# EAGLE design Motherboard (EAGLE 7.5.0)
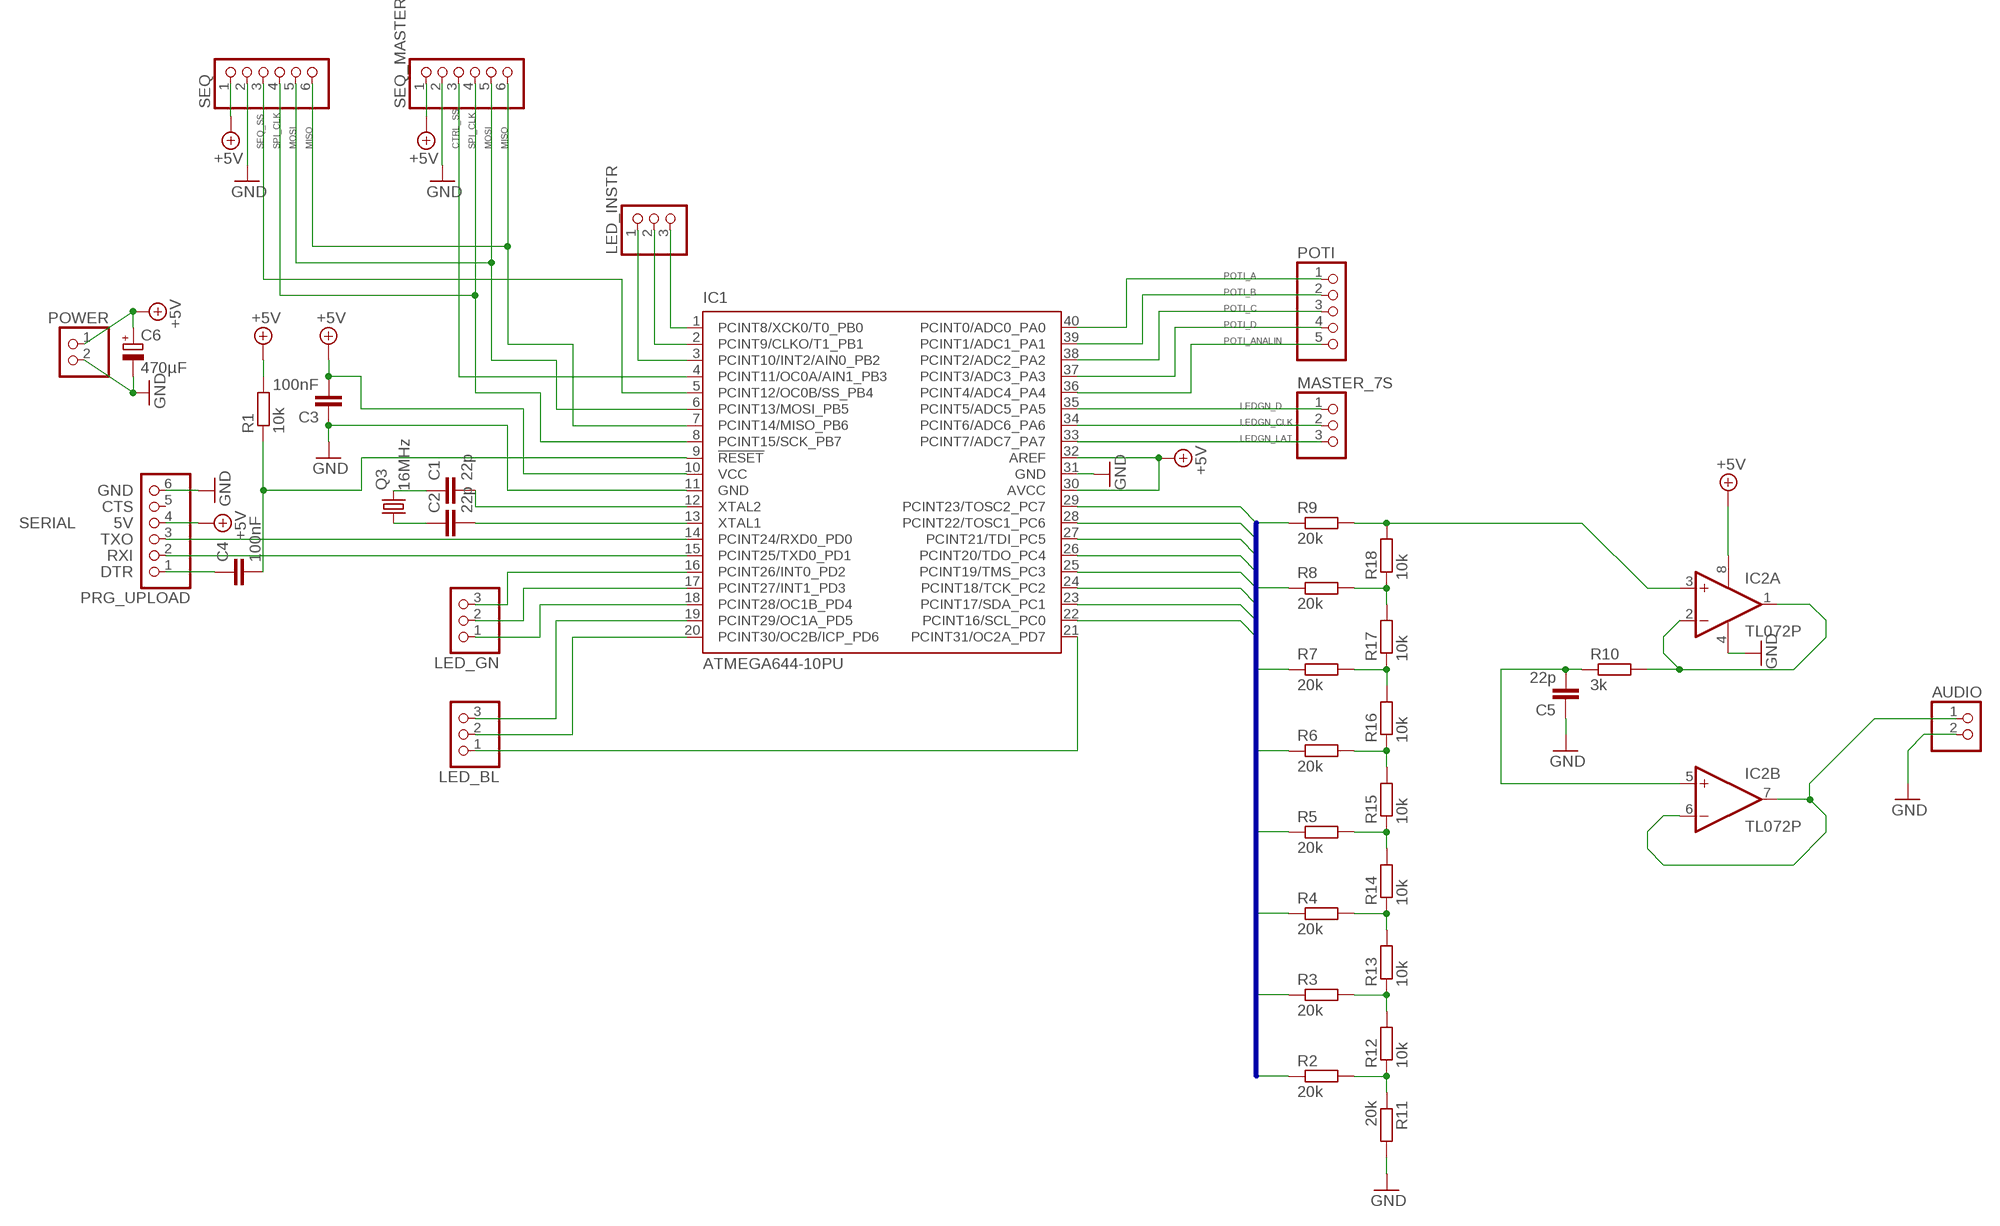
[diagram p0: schematic, sheet 1]

## Parts
AUDIO  PINHD-1X2  [1X02]
C1  22p  C-EU025-060X050  [C025-060X050]
C2  22p  C-EU025-060X050  [C025-060X050]
C3  100nF  C-EU025-060X050  [C025-060X050]
C4  100nF  C-EU025-060X050  [C025-060X050]
C5  22p  C-EU025-060X050  [C025-060X050]
C6  470µF  CPOL-EUE3.5-10  [E3,5-10]
IC1  ATMEGA644-10PU  [DIL40]
IC2  TL072P  [DIL08]
LED_BL  PINHD-1X3  [1X03]
LED_GN  PINHD-1X3  [1X03]
LED_INSTR  PINHD-1X3  [1X03]
MASTER_7S  PINHD-1X3  [1X03]
POTI  PINHD-1X5  [1X05]
POWER  PINHD-1X2  [1X02]
PRG_UPLOAD  PINHD-1X6  [1X06]
Q3  16MHz  CRYSTALHC18U-V  [HC18U-V]
R1  10k  R-EU_0204/7  [0204/7]
R2  20k  R-EU_0204/7  [0204/7]
R3  20k  R-EU_0204/7  [0204/7]
R4  20k  R-EU_0204/7  [0204/7]
R5  20k  R-EU_0204/7  [0204/7]
R6  20k  R-EU_0204/7  [0204/7]
R7  20k  R-EU_0204/7  [0204/7]
R8  20k  R-EU_0204/7  [0204/7]
R9  20k  R-EU_0204/7  [0204/7]
R10  3k  R-EU_0204/7  [0204/7]
R11  20k  R-EU_0204/7  [0204/7]
R12  10k  R-EU_0204/7  [0204/7]
R13  10k  R-EU_0204/7  [0204/7]
R14  10k  R-EU_0204/7  [0204/7]
R15  10k  R-EU_0204/7  [0204/7]
R16  10k  R-EU_0204/7  [0204/7]
R17  10k  R-EU_0204/7  [0204/7]
R18  10k  R-EU_0204/7  [0204/7]
SEQ  PINHD-1X6  [1X06]
SEQ_MASTER  PINHD-1X6  [1X06]

## Nets
+5V: C3.2 C6.+ IC1.10(VCC) IC1.30(AVCC) IC1.32(AREF) IC2.8(P:V+) POWER.1 PRG_UPLOAD.4 R1.2 SEQ.1 SEQ_MASTER.1
CTRL_SS: IC1.4(PCINT11/OC0A/AIN1_PB3) SEQ_MASTER.3
DA0: IC1.22(PCINT16/SCL_PC0) R2.1
DA1: IC1.23(PCINT17/SDA_PC1) R3.1
DA2: IC1.24(PCINT18/TCK_PC2) R4.1
DA3: IC1.25(PCINT19/TMS_PC3) R5.1
DA4: IC1.26(PCINT20/TDO_PC4) R6.1
DA5: IC1.27(PCINT21/TDI_PC5) R7.1
DA6: IC1.28(PCINT22/TOSC1_PC6) R8.1
DA7: IC1.29(PCINT23/TOSC2_PC7) R9.1
GND: AUDIO.2 C3.1 C5.1 C6.- IC1.11(GND) IC1.31(GND) IC2.4(P:V-) POWER.2 PRG_UPLOAD.6 R11.2 SEQ.2 SEQ_MASTER.2
LEDGN_CLK: IC1.34(PCINT6/ADC6_PA6) MASTER_7S.2
LEDGN_D: IC1.35(PCINT5/ADC5_PA5) MASTER_7S.1
LEDGN_LAT: IC1.33(PCINT7/ADC7_PA7) MASTER_7S.3
MISO: IC1.7(PCINT14/MISO_PB6) SEQ.6 SEQ_MASTER.6
MOSI: IC1.6(PCINT13/MOSI_PB5) SEQ.5 SEQ_MASTER.5
N$1: C1.1 Q3.2
N$2: C2.1 Q3.1
N$3: C2.2 IC1.13(XTAL1)
N$4: C1.2 IC1.12(XTAL2)
N$5: R3.2 R12.2 R13.1
N$6: R4.2 R13.2 R14.1
N$7: R5.2 R14.2 R15.1
N$8: R6.2 R15.2 R16.1
N$9: IC1.1(PCINT8/XCK0/T0_PB0) LED_INSTR.3
N$10: IC1.2(PCINT9/CLKO/T1_PB1) LED_INSTR.2
N$11: IC1.3(PCINT10/INT2/AIN0_PB2) LED_INSTR.1
N$12: R7.2 R16.2 R17.1
N$13: R8.2 R17.2 R18.1
N$14: R2.2 R11.1 R12.1
N$15: IC2.3(A:+IN) R9.2 R18.2
N$16: IC2.1(A:OUT) IC2.2(A:-IN) R10.2
N$17: IC1.16(PCINT26/INT0_PD2) LED_GN.3
N$18: IC1.17(PCINT27/INT1_PD3) LED_GN.2
N$19: IC1.18(PCINT28/OC1B_PD4) LED_GN.1
N$20: IC1.19(PCINT29/OC1A_PD5) LED_BL.3
N$21: IC1.20(PCINT30/OC2B/ICP_PD6) LED_BL.2
N$22: IC1.21(PCINT31/OC2A_PD7) LED_BL.1
N$23: C5.2 IC2.5(B:+IN) R10.1
N$24: AUDIO.1 IC2.6(B:-IN) IC2.7(B:OUT)
POTI_A: IC1.40(PCINT0/ADC0_PA0) POTI.1
POTI_ANALIN: IC1.36(PCINT4/ADC4_PA4) POTI.5
POTI_B: IC1.39(PCINT1/ADC1_PA1) POTI.2
POTI_C: IC1.38(PCINT2/ADC2_PA2) POTI.3
POTI_D: IC1.37(PCINT3/ADC3_PA3) POTI.4
RESET: C4.2 IC1.9(!RESET) R1.1
SEQ_SS: IC1.5(PCINT12/OC0B/SS_PB4) SEQ.3
SPI_CLK: IC1.8(PCINT15/SCK_PB7) SEQ.4 SEQ_MASTER.4
UPLOAD_DTR: C4.1 PRG_UPLOAD.1
UPLOAD_RXI: IC1.15(PCINT25/TXD0_PD1) PRG_UPLOAD.2
UPLOAD_TXO: IC1.14(PCINT24/RXD0_PD0) PRG_UPLOAD.3
Unconnected: PRG_UPLOAD.5

## Buses
DA[0..7]

## Notes on the sheet
- GND
- CTS
- SERIAL | 5V
- TXO
- RXI
- DTR

## Library data of the parts
AUDIO POWER = pinhead:PINHD-1X2: PIN HEADER
C1-C5 = resistor:C-EU: CAPACITOR, European symbol
C6 = resistor:CPOL-EU: POLARIZED CAPACITOR, European symbol
IC1 = atmel:ATMEGA644-*PU: 8-bit Microcontroller with 64K Bytes In-System Programmable Flash Auto generated by make-symbol-device-package-bsdl.ulp Rev. 34 Source: http://www.atmel.com/dyn/resources/prod_documents/doc2593.pdf; MPN: ATMEGA644V-10PU; OC_FARNELL: 1288342; OC_NEWARK: 23M5062
IC2 = linear:TL072: OP AMP
LED_BL LED_GN LED_INSTR MASTER_7S = pinhead:PINHD-1X3: PIN HEADER
POTI = pinhead:PINHD-1X5: PIN HEADER
PRG_UPLOAD SEQ SEQ_MASTER = pinhead:PINHD-1X6: PIN HEADER
Q3 = crystal:CRYSTAL: CRYSTAL; OC_FARNELL: unknown; OC_NEWARK: unknown
R1-R18 = resistor:R-EU_: RESISTOR, European symbol

## Board
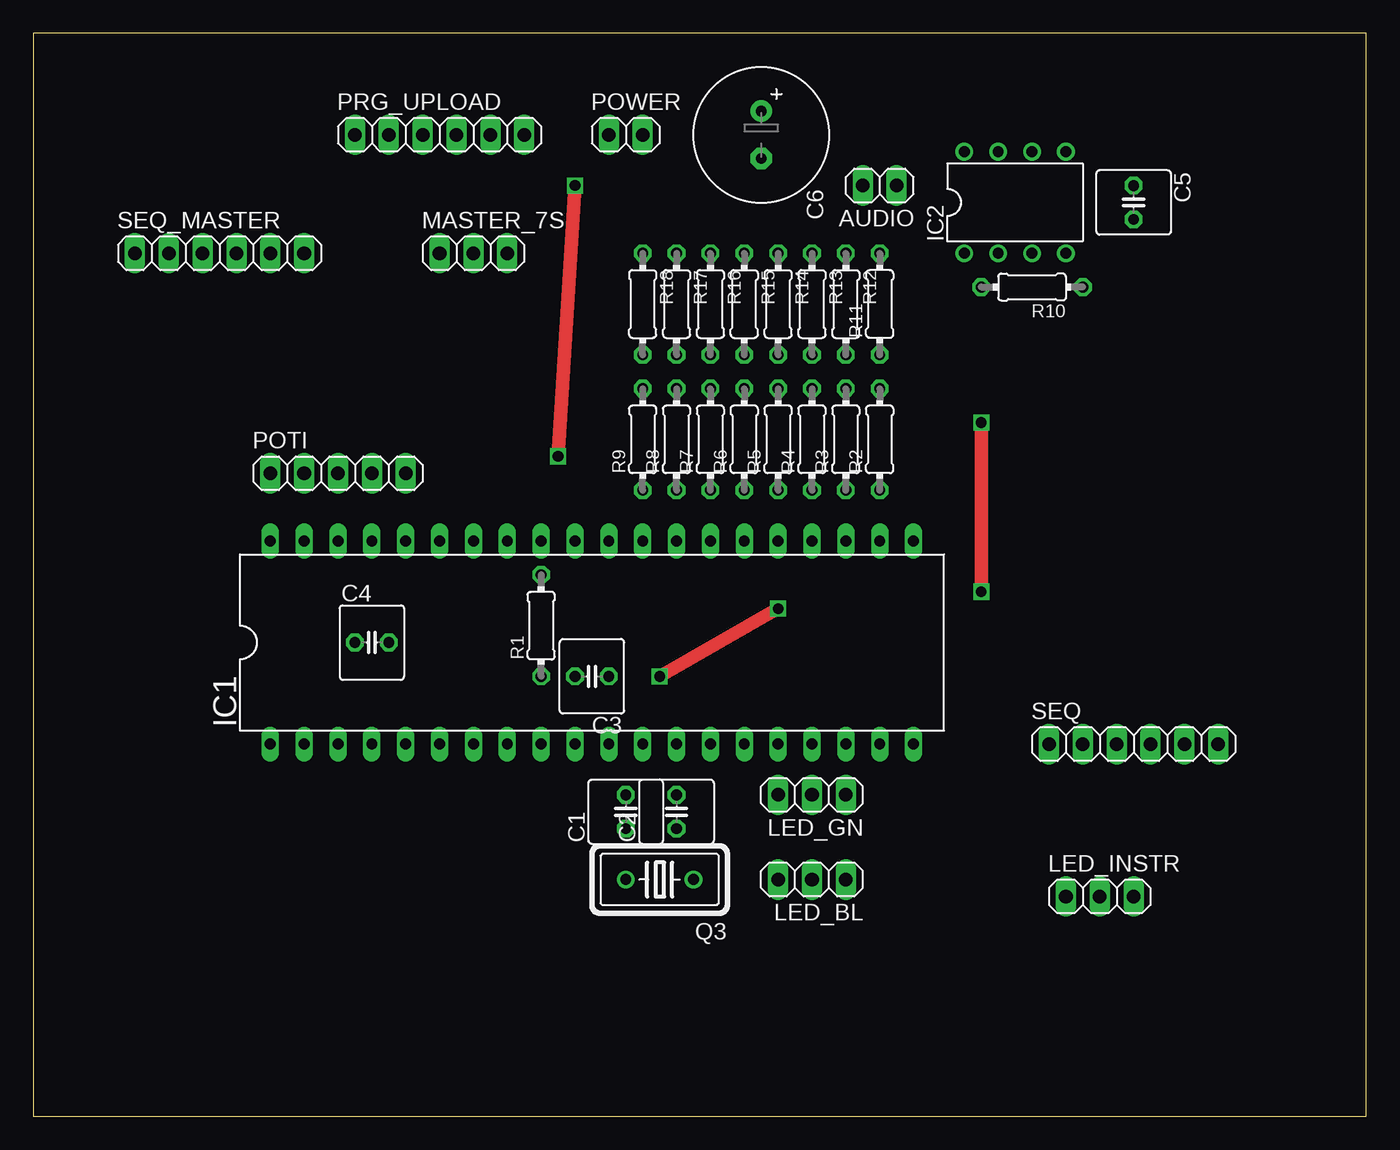
[diagram p1: board, top side]
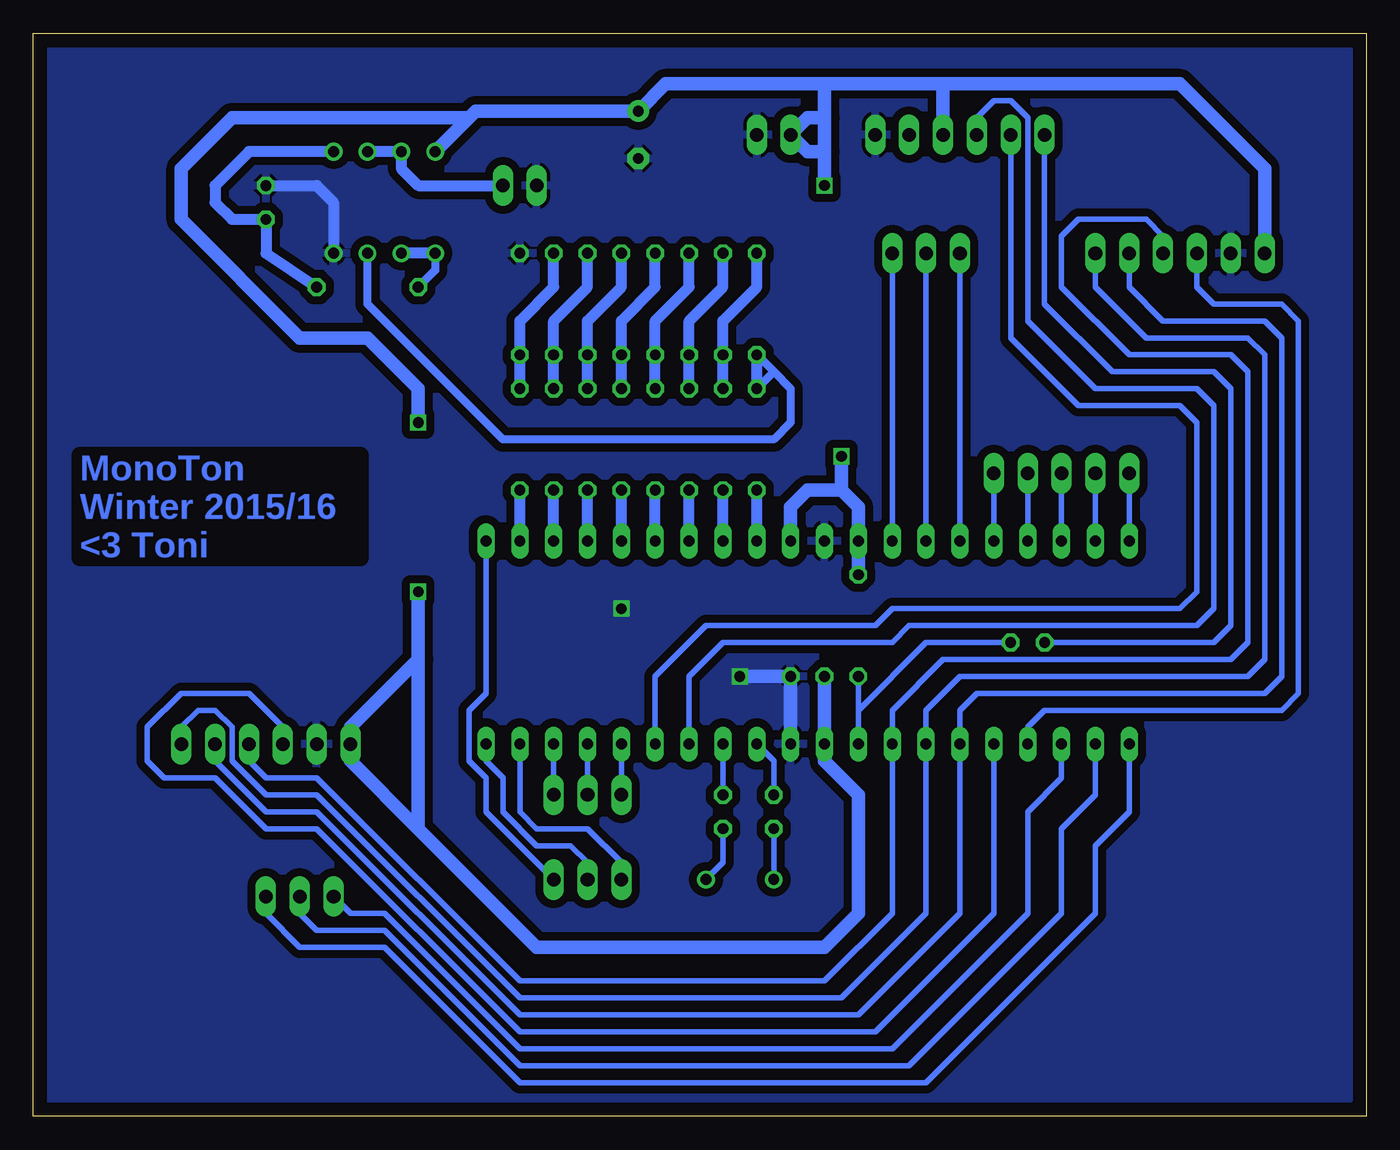
[diagram p2: board, bottom side, seen from below]

Size 100 x 81.27 mm. Coordinates in mm from the lower left corner, seen from the top.
Outline: 0,0 100,0 100,81.27 0,81.27 0,0
Copper layers (1*16): Top 0.035mm / dielectric 1.5mm / Bottom 0.035mm
Design rules "default": minimum track width 10mil, minimum drill 24mil, track to track 8mil, track to pad 8mil, pad to pad 8mil, via to via 8mil, smd to smd 8mil, copper to edge 40mil, drill to drill 8mil, minimum pad ring 10mil, minimum via ring 8mil, stop-mask expansion 4mil, vias tented up to drill 0mil, thermal gap 10mil

### Footprints (pad centres in the part's own frame; a part is rotated, then mirrored left to right if it is on the bottom)
1X02 = drill 1.016 long: 1 -1.27,0; 2 1.27,0
C025-060X050 = drill 0.813 octagon: 1 -1.27,0; 2 1.27,0
E3,5-10 = drill 0.813 pad 1.6: + -1.778,0 | drill 0.813 pad 1.6 octagon: - 1.778,0
DIL40 = drill 0.813 long: 1 -24.13,-7.62; 2 -21.59,-7.62; 3 -19.05,-7.62; 4 -16.51,-7.62; 5 -13.97,-7.62; 6 -11.43,-7.62; 7 -8.89,-7.62; 8 -6.35,-7.62; 9 -3.81,-7.62; 10 -1.27,-7.62; 11 1.27,-7.62; 12 3.81,-7.62; 13 6.35,-7.62; 14 8.89,-7.62; 15 11.43,-7.62; 16 13.97,-7.62; 17 16.51,-7.62; 18 19.05,-7.62; 19 21.59,-7.62; 20 24.13,-7.62; 21 24.13,7.62; 22 21.59,7.62; 23 19.05,7.62; 24 16.51,7.62; 25 13.97,7.62; 26 11.43,7.62; 27 8.89,7.62; 28 6.35,7.62; 29 3.81,7.62; 30 1.27,7.62; 31 -1.27,7.62; 32 -3.81,7.62; 33 -6.35,7.62; 34 -8.89,7.62; 35 -11.43,7.62; 36 -13.97,7.62; 37 -16.51,7.62; 38 -19.05,7.62; 39 -21.59,7.62; 40 -24.13,7.62
DIL08 = drill 0.813 pad 1.27: 1 -3.81,-3.81; 2 -1.27,-3.81; 3 1.27,-3.81; 4 3.81,-3.81; 5 3.81,3.81; 6 1.27,3.81; 7 -1.27,3.81; 8 -3.81,3.81
1X03 = drill 1.016 long: 1 -2.54,0; 2 0,0; 3 2.54,0
1X05 = drill 1.016 long: 1 -5.08,0; 2 -2.54,0; 3 0,0; 4 2.54,0; 5 5.08,0
1X06 = drill 1.016 long: 1 -6.35,0; 2 -3.81,0; 3 -1.27,0; 4 1.27,0; 5 3.81,0; 6 6.35,0
HC18U-V = drill 0.813: 1 -2.54,0; 2 2.54,0
0204/7 = drill 0.813 octagon: 1 -3.81,0; 2 3.81,0

### Placement (x,y rotation side)
AUDIO  63.5,69.85 180 top
C1  44.45,22.86 90 top
C2  48.26,22.86 90 top
C3  41.91,33.02 180 top
C4  25.4,35.56 0 top
C5  82.55,68.58 270 top
C6  54.61,73.66 270 top
IC1  41.91,35.56 0 top
IC2  73.66,68.58 0 top
LED_BL  58.42,17.78 180 top
LED_GN  58.42,24.13 180 top
LED_INSTR  80.01,16.51 0 top
MASTER_7S  33.02,64.77 0 top
POTI  22.86,48.26 0 top
POWER  44.45,73.66 0 top
PRG_UPLOAD  30.48,73.66 0 top
Q3  46.99,17.78 180 top
R1  38.1,36.83 90 top
R2  63.5,50.8 90 top
R3  60.96,50.8 90 top
R4  58.42,50.8 90 top
R5  55.88,50.8 90 top
R6  53.34,50.8 90 top
R7  50.8,50.8 90 top
R8  48.26,50.8 90 top
R9  45.72,50.8 90 top
R10  74.93,62.23 180 top
R11  63.5,60.96 90 top
R12  60.96,60.96 270 top
R13  58.42,60.96 270 top
R14  55.88,60.96 270 top
R15  53.34,60.96 270 top
R16  50.8,60.96 270 top
R17  48.26,60.96 270 top
R18  45.72,60.96 270 top
SEQ  82.55,27.94 0 top
SEQ_MASTER  13.97,64.77 0 top

### Tracks (layer width: path | path; a pad name or v marks a point on that pad's centre or on a via)
+5V  (via drill 0.8)
  Top 1.016: v39.37,49.53 v40.64,69.85 | v71.12,39.37 v71.12,52.07
  Bottom 1.016: 39.37,46.99 38.1,45.72 IC1.32 R1.2 | IC1.30 43.18,45.72 41.91,46.99 39.37,46.99 | SEQ_MASTER.1 7.62,71.12 13.97,77.47 31.75,77.47 | 31.75,77.47 40.64,77.47 | 40.64,77.47 52.58,77.47 C6.+ 66.8,75.44 67.31,74.93 | PRG_UPLOAD.4 31.75,77.47 | 39.37,46.99 v39.37,49.53 | C3.2 IC1.10 40.64,26.67 38.1,24.13 38.1,15.24 40.64,12.7 62.23,12.7 71.12,21.59 | 71.12,21.59 76.2,26.67 SEQ.1 76.2,29.21 71.12,34.29 | v71.12,52.07 71.12,54.61 74.93,58.42 80.01,58.42 88.9,67.31 88.9,71.12 85.09,74.93 67.31,74.93 | 67.31,74.93 IC2.8 | 71.12,21.59 71.12,34.29 | 71.12,34.29 v71.12,39.37 | 40.64,74.93 40.64,77.47 | v40.64,69.85 40.64,72.39 | 40.64,72.39 40.64,74.93 | 40.64,74.93 41.91,74.93 POWER.1 41.91,72.39 40.64,72.39
CTRL_SS
  Bottom 0.406: IC1.4 25.4,29.21 24.13,30.48 6.35,30.48 5.08,31.75 5.08,59.69 6.35,60.96 11.43,60.96 12.7,62.23 SEQ_MASTER.3
DA0
  Bottom 0.813: IC1.22 R2.1
DA1
  Bottom 0.813: IC1.23 R3.1
DA2
  Bottom 0.813: IC1.24 R4.1
DA3
  Bottom 0.813: IC1.25 R5.1
DA4
  Bottom 0.813: IC1.26 R6.1
DA5
  Bottom 0.813: IC1.27 R7.1
DA6
  Bottom 0.813: IC1.28 R8.1
DA7
  Bottom 0.813: IC1.29 R9.1
GND  (via drill 0.8)
  Top 1.016: v46.99,33.02 v55.88,38.1
  Bottom 0.813: C5.1 78.74,69.85 77.47,68.58 IC2.4
  Bottom 1.016: IC1.11 C3.1 v46.99,33.02
  pour Bottom (isolate 0.61): 1.27,80.01 1.27,1.27 99.06,1.27 99.06,80.01
LEDGN_CLK
  Bottom 0.406: MASTER_7S.2 IC1.34
LEDGN_D
  Bottom 0.406: IC1.35 MASTER_7S.1
LEDGN_LAT
  Bottom 0.406: MASTER_7S.3 IC1.33
MISO
  Bottom 0.406: SEQ_MASTER.6 20.32,62.23 16.51,58.42 8.89,58.42 7.62,57.15 7.62,34.29 8.89,33.02 30.48,33.02 33.02,30.48 IC1.7 33.02,15.24 39.37,8.89 63.5,8.89 78.74,24.13 82.55,24.13 85.09,26.67 85.09,29.21 86.36,30.48 87.63,30.48 88.9,29.21 SEQ.6
MOSI
  Bottom 0.406: SEQ_MASTER.5 17.78,62.23 15.24,59.69 7.62,59.69 6.35,58.42 6.35,33.02 7.62,31.75 29.21,31.75 30.48,30.48 IC1.6 30.48,15.24 38.1,7.62 63.5,7.62 78.74,22.86 82.55,22.86 86.36,26.67 SEQ.5
N$1
  Bottom 0.406: C1.1 Q3.2
N$2
  Bottom 0.406: Q3.1 48.26,19.05 C2.1
N$3
  Bottom 0.406: C2.2 IC1.13
N$4
  Bottom 0.406: IC1.12 44.45,26.67 C1.2
N$5
  Bottom 0.813: R3.2 R12.2 60.96,59.69 58.42,62.23 R13.1
N$6
  Bottom 0.813: R4.2 R13.2 58.42,59.69 55.88,62.23 R14.1
N$7
  Bottom 0.813: R5.2 R14.2 55.88,59.69 53.34,62.23 R15.1
N$8
  Bottom 0.813: R6.2 R15.2 53.34,59.69 50.8,62.23 R16.1
N$9
  Bottom 0.406: IC1.1 17.78,22.86 20.32,20.32 20.32,15.24 33.02,2.54 63.5,2.54 73.66,12.7 80.01,12.7 82.55,15.24 LED_INSTR.3
N$10
  Bottom 0.406: IC1.2 20.32,24.13 22.86,21.59 22.86,15.24 34.29,3.81 63.5,3.81 73.66,13.97 78.74,13.97 80.01,15.24 LED_INSTR.2
N$11
  Bottom 0.406: IC1.3 22.86,25.4 25.4,22.86 25.4,15.24 35.56,5.08 63.5,5.08 73.66,15.24 76.2,15.24 LED_INSTR.1
N$12
  Bottom 0.813: R7.2 R16.2 50.8,59.69 48.26,62.23 R17.1
N$13
  Bottom 0.813: R8.2 R17.2 48.26,59.69 45.72,62.23 R18.1
N$14
  Bottom 0.813: R2.2 R11.1 63.5,59.69 60.96,62.23 R12.1
N$15
  Bottom 0.61: R18.2 44.45,55.88 | R9.2 44.45,55.88 | 44.45,55.88 43.18,54.61 43.18,52.07 44.45,50.8 64.77,50.8 74.93,60.96 IC2.3
  Bottom 0.813: R9.2 R18.2
N$16
  Bottom 0.61: IC2.1 69.85,63.5 R10.2
  Bottom 0.813: IC2.1 IC2.2
N$17
  Bottom 0.406: IC1.16 LED_GN.3
N$18
  Bottom 0.406: IC1.17 LED_GN.2
N$19
  Bottom 0.406: IC1.18 LED_GN.1
N$20
  Bottom 0.406: IC1.19 63.5,22.86 62.23,21.59 58.42,21.59 55.88,19.05 LED_BL.3
N$21
  Bottom 0.406: LED_BL.2 58.42,19.05 59.69,20.32 62.23,20.32 64.77,22.86 64.77,25.4 66.04,26.67 IC1.20
N$22
  Bottom 0.406: IC1.21 66.04,31.75 67.31,30.48 67.31,26.67 66.04,25.4 66.04,22.86 LED_BL.1
N$23
  Bottom 0.813: R10.1 82.55,64.77 C5.2 85.09,67.31 86.36,68.58 86.36,69.85 83.82,72.39 IC2.5
N$24
  Bottom 0.813: IC2.6 IC2.7 72.39,71.12 71.12,69.85 AUDIO.1
POTI_A
  Bottom 0.406: POTI.1 IC1.40
POTI_ANALIN
  Bottom 0.406: POTI.5 IC1.36
POTI_B
  Bottom 0.406: IC1.39 POTI.2
POTI_C
  Bottom 0.406: POTI.3 IC1.38
POTI_D
  Bottom 0.406: IC1.37 POTI.4
RESET
  Bottom 0.406: C4.2 33.02,35.56 38.1,30.48 IC1.9 R1.1
SEQ_SS
  Bottom 0.406: IC1.5 27.94,15.24 36.83,6.35 63.5,6.35 78.74,21.59 82.55,21.59 86.36,25.4 90.17,25.4 91.44,26.67 91.44,29.21 88.9,31.75 83.82,31.75 81.28,29.21 SEQ.3
SPI_CLK
  Bottom 0.406: SEQ_MASTER.4 15.24,66.04 16.51,67.31 21.59,67.31 22.86,66.04 22.86,62.23 17.78,57.15 10.16,57.15 8.89,55.88 8.89,35.56 10.16,34.29 31.75,34.29 35.56,30.48 IC1.8 35.56,15.24 40.64,10.16 63.5,10.16 78.74,25.4 82.55,25.4 83.82,26.67 SEQ.4
UPLOAD_DTR
  Bottom 0.406: C4.1 11.43,35.56 10.16,36.83 10.16,54.61 11.43,55.88 19.05,55.88 24.13,60.96 PRG_UPLOAD.1
UPLOAD_RXI
  Bottom 0.406: PRG_UPLOAD.2 26.67,58.42 21.59,53.34 13.97,53.34 12.7,52.07 12.7,39.37 13.97,38.1 35.56,38.1 36.83,36.83 49.53,36.83 53.34,33.02 IC1.15
UPLOAD_TXO
  Bottom 0.406: PRG_UPLOAD.3 29.21,74.93 27.94,76.2 26.67,76.2 25.4,74.93 25.4,59.69 20.32,54.61 12.7,54.61 11.43,53.34 11.43,38.1 12.7,36.83 34.29,36.83 35.56,35.56 48.26,35.56 50.8,33.02 IC1.14

### Text on the board
Bottom: MonoTon / Winter 2015/16 / <3 Toni